# Altium project PCB_3U_DAC.PrjPCB (part 1 of 3)
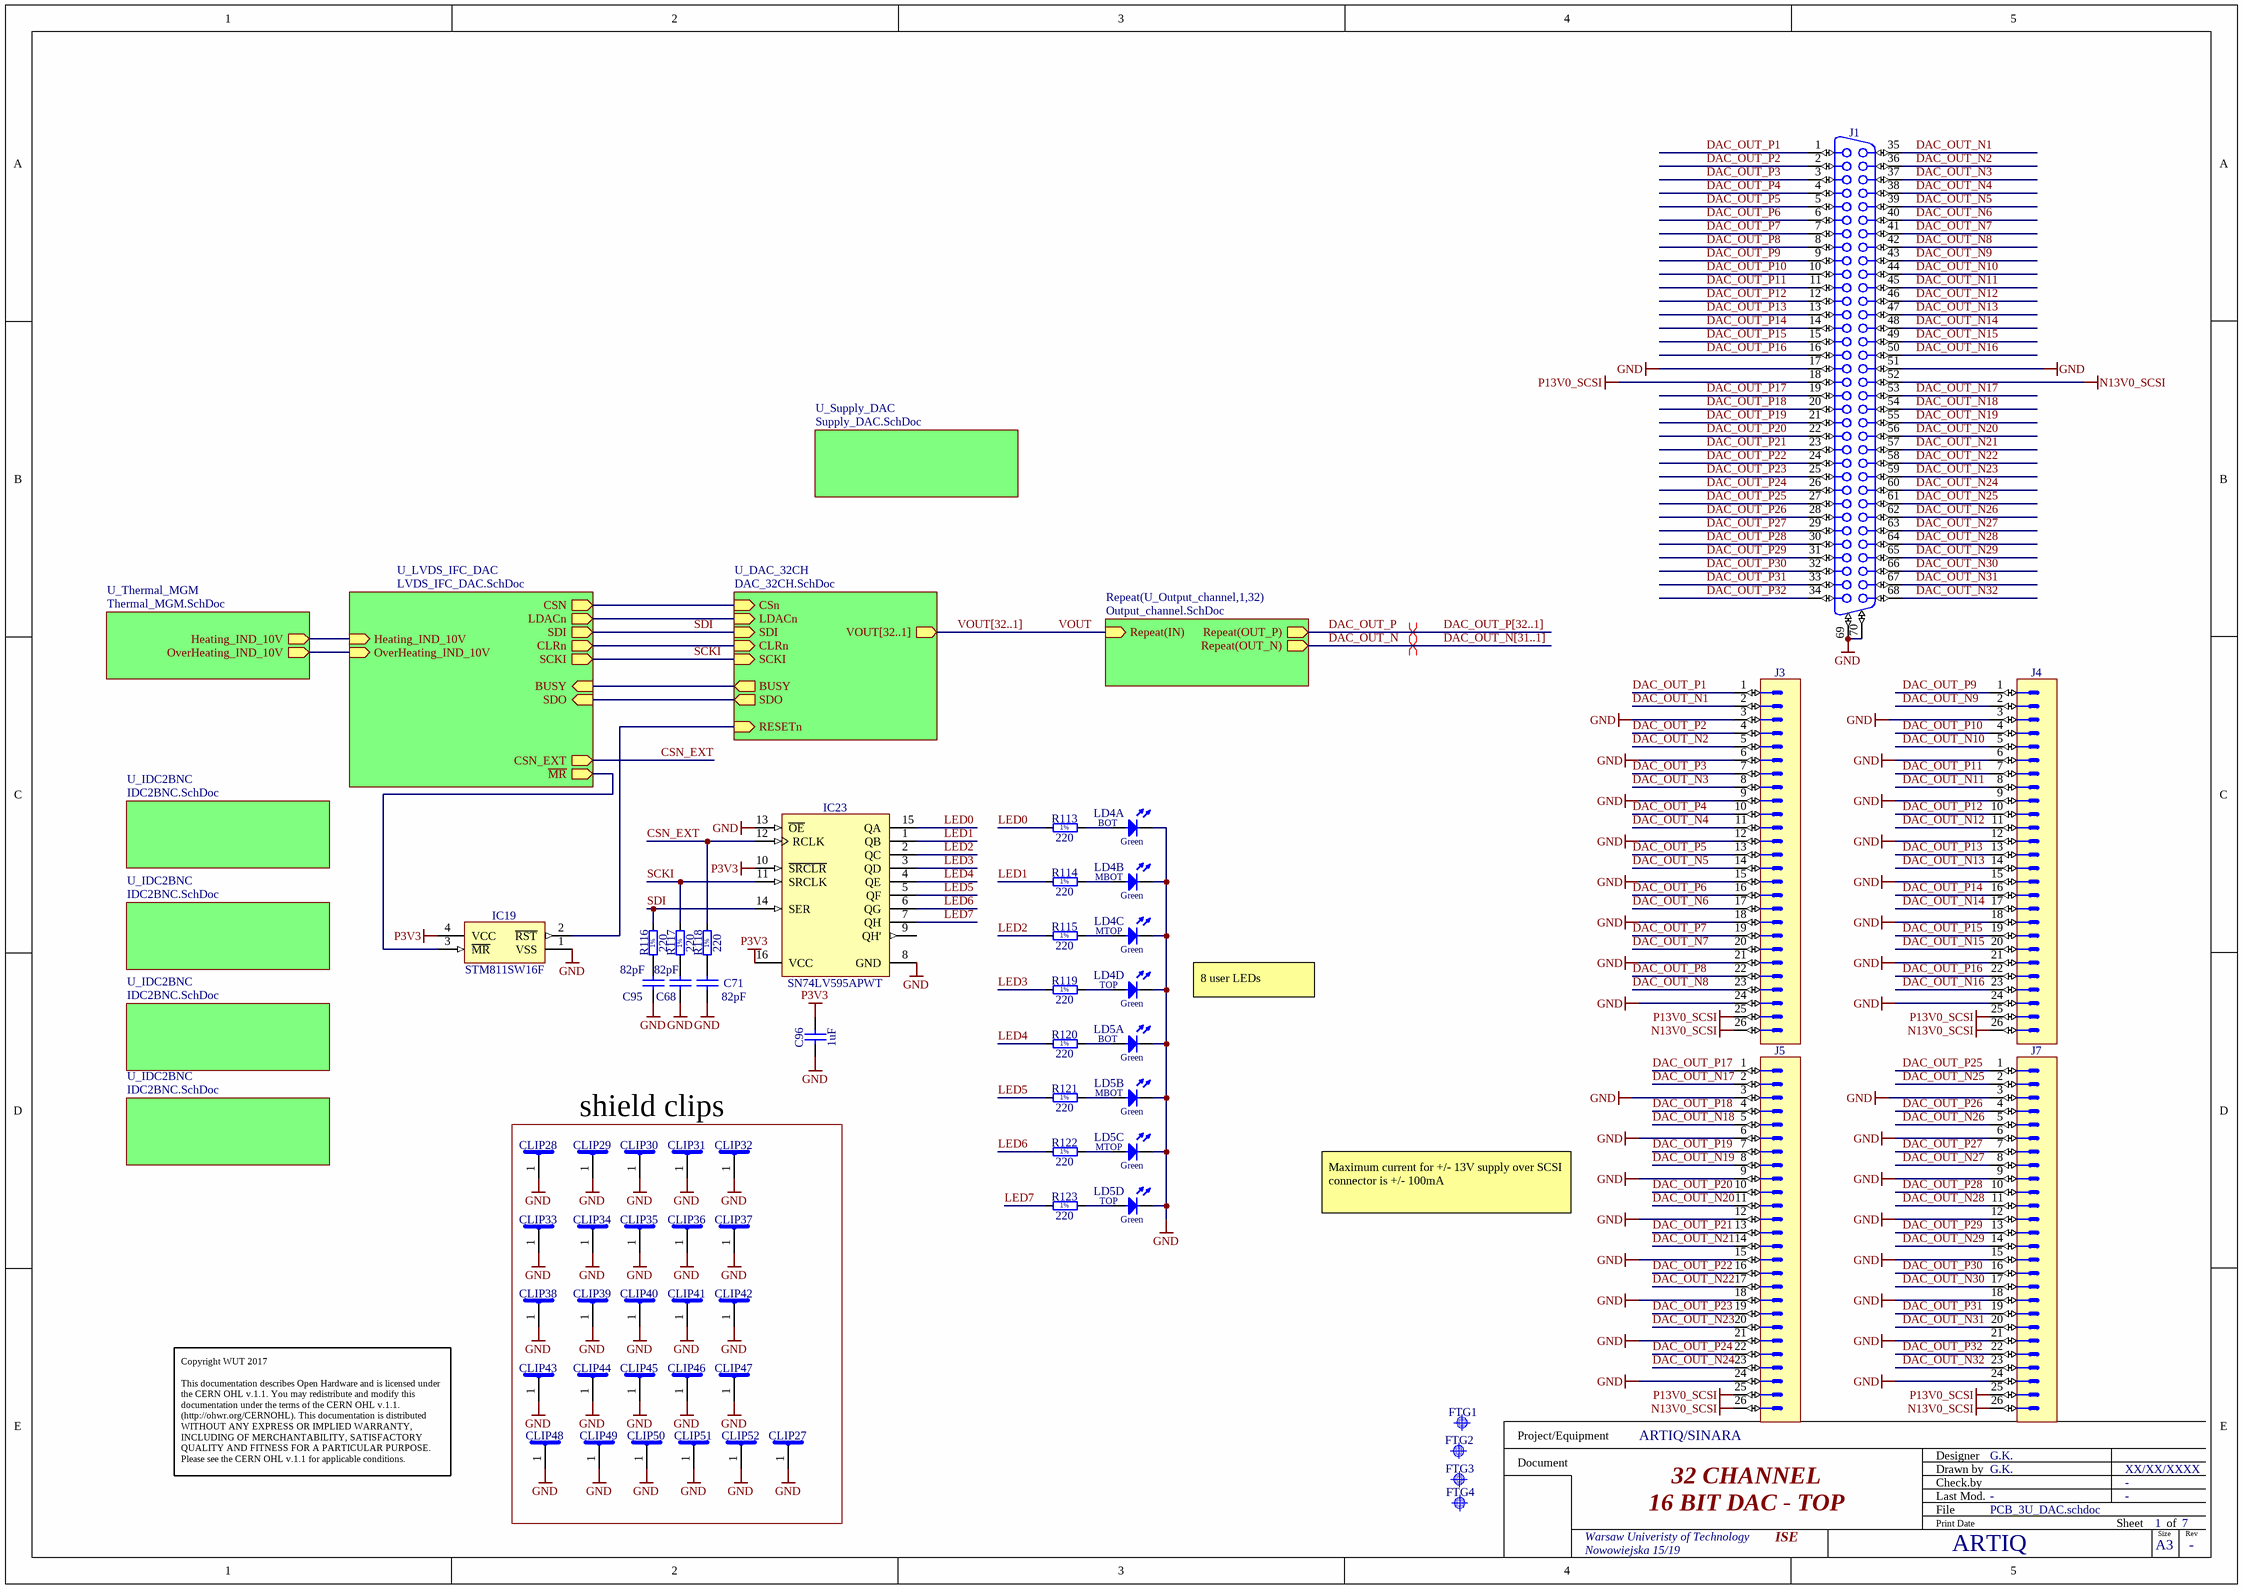
[diagram p0: PCB_3U_DAC.schdoc]
7 sheets, 825 parts. Net scope: hierarchical (ports join the sheet entries above them; power ports are global).
Board file: PCB_3U_DAC.PCBDOC
Sheets:
  PCB_3U_DAC.schdoc
    U_Supply_DAC = Supply_DAC.SchDoc
    U_Output_channel1 = Output_channel.SchDoc
    U_Output_channel2 = Output_channel.SchDoc
    U_Output_channel3 = Output_channel.SchDoc
    U_Output_channel4 = Output_channel.SchDoc
    U_Output_channel5 = Output_channel.SchDoc
    U_Output_channel6 = Output_channel.SchDoc
    U_Output_channel7 = Output_channel.SchDoc
    U_Output_channel8 = Output_channel.SchDoc
    U_Output_channel9 = Output_channel.SchDoc
    U_Output_channel10 = Output_channel.SchDoc
    U_Output_channel11 = Output_channel.SchDoc
    U_Output_channel12 = Output_channel.SchDoc
    U_Output_channel13 = Output_channel.SchDoc
    U_Output_channel14 = Output_channel.SchDoc
    U_Output_channel15 = Output_channel.SchDoc
    U_Output_channel16 = Output_channel.SchDoc
    U_Output_channel17 = Output_channel.SchDoc
    U_Output_channel18 = Output_channel.SchDoc
    U_Output_channel19 = Output_channel.SchDoc
    U_Output_channel20 = Output_channel.SchDoc
    U_Output_channel21 = Output_channel.SchDoc
    U_Output_channel22 = Output_channel.SchDoc
    U_Output_channel23 = Output_channel.SchDoc
    U_Output_channel24 = Output_channel.SchDoc
    U_Output_channel25 = Output_channel.SchDoc
    U_Output_channel26 = Output_channel.SchDoc
    U_Output_channel27 = Output_channel.SchDoc
    U_Output_channel28 = Output_channel.SchDoc
    U_Output_channel29 = Output_channel.SchDoc
    U_Output_channel30 = Output_channel.SchDoc
    U_Output_channel31 = Output_channel.SchDoc
    U_Output_channel32 = Output_channel.SchDoc
    U_DAC_32CH = DAC_32CH.SchDoc
    U_LVDS_IFC_DAC = LVDS_IFC_DAC.SchDoc
    U_Thermal_MGM = Thermal_MGM.SchDoc
    U_IDC2BNC = IDC2BNC.SchDoc
    U_IDC2BNC = IDC2BNC.SchDoc
    U_IDC2BNC = IDC2BNC.SchDoc
    U_IDC2BNC = IDC2BNC.SchDoc

## Sheet PCB_3U_DAC.schdoc: 32 CHANNEL
size 420 x 297 mm; Author: G.K.; CompanyName: WUT; DrawnBy: G.K.; Organization: WUT ISE; Address1: Warsaw Univeristy of Technology; Address2: Nowowiejska 15/19; DocumentNumber: 1; Revision: -; SheetNumber: 1; SheetTotal: 7; EDA_Number: ARTIQ; Projet: ARTIQ/SINARA; ModifiedBy: -; CreateDate: XX/XX/XXXX; CheckedDate: -; Title2: 16 BIT DAC - TOP; DivGrp: ISE; Designer: G.K.; ModifiedDate: -; ProjectName: 32 CHANNEL 16bit DAC

### Parts
C68  82pF  [CAPC1608X87N]
C71  82pF  [CAPC1608X87N]
C95  82pF  [CAPC1608X87N]
C96  1uF  [CAPC1608X87N]
CLIP27  S1411-46R  [CLIP_HOLLAND-SHIELDING_LC]  (value not drawn)
CLIP28  S1411-46R  [CLIP_HOLLAND-SHIELDING_LC]  (value not drawn)
CLIP29  S1411-46R  [CLIP_HOLLAND-SHIELDING_LC]  (value not drawn)
CLIP30  S1411-46R  [CLIP_HOLLAND-SHIELDING_LC]  (value not drawn)
CLIP31  S1411-46R  [CLIP_HOLLAND-SHIELDING_LC]  (value not drawn)
CLIP32  S1411-46R  [CLIP_HOLLAND-SHIELDING_LC]  (value not drawn)
CLIP33  S1411-46R  [CLIP_HOLLAND-SHIELDING_LC]  (value not drawn)
CLIP34  S1411-46R  [CLIP_HOLLAND-SHIELDING_LC]  (value not drawn)
CLIP35  S1411-46R  [CLIP_HOLLAND-SHIELDING_LC]  (value not drawn)
CLIP36  S1411-46R  [CLIP_HOLLAND-SHIELDING_LC]  (value not drawn)
CLIP37  S1411-46R  [CLIP_HOLLAND-SHIELDING_LC]  (value not drawn)
CLIP38  S1411-46R  [CLIP_HOLLAND-SHIELDING_LC]  (value not drawn)
CLIP39  S1411-46R  [CLIP_HOLLAND-SHIELDING_LC]  (value not drawn)
CLIP40  S1411-46R  [CLIP_HOLLAND-SHIELDING_LC]  (value not drawn)
CLIP41  S1411-46R  [CLIP_HOLLAND-SHIELDING_LC]  (value not drawn)
CLIP42  S1411-46R  [CLIP_HOLLAND-SHIELDING_LC]  (value not drawn)
CLIP43  S1411-46R  [CLIP_HOLLAND-SHIELDING_LC]  (value not drawn)
CLIP44  S1411-46R  [CLIP_HOLLAND-SHIELDING_LC]  (value not drawn)
CLIP45  S1411-46R  [CLIP_HOLLAND-SHIELDING_LC]  (value not drawn)
CLIP46  S1411-46R  [CLIP_HOLLAND-SHIELDING_LC]  (value not drawn)
CLIP47  S1411-46R  [CLIP_HOLLAND-SHIELDING_LC]  (value not drawn)
CLIP48  S1411-46R  [CLIP_HOLLAND-SHIELDING_LC]  (value not drawn)
CLIP49  S1411-46R  [CLIP_HOLLAND-SHIELDING_LC]  (value not drawn)
CLIP50  S1411-46R  [CLIP_HOLLAND-SHIELDING_LC]  (value not drawn)
CLIP51  S1411-46R  [CLIP_HOLLAND-SHIELDING_LC]  (value not drawn)
CLIP52  S1411-46R  [CLIP_HOLLAND-SHIELDING_LC]  (value not drawn)
FTG1  Use only in PCB  [FIDUCIAL_TOP_C100-200]  (value not drawn)
FTG2  Use only in PCB  [FIDUCIAL_TOP_S100-200]  (value not drawn)
FTG3  Use only in PCB  [FIDUCIAL_TOP_S200-400]  (value not drawn)
FTG4  Use only in PCB  [FIDUCIAL_TOP_S100-200]  (value not drawn)
IC19  STM811SW16F  [SOT143N]
IC23  SN74LV595APWT  [SOP65P640X120-16N]
J1  D-SUB  [TYCO_5787082-7]  (value not drawn)
J3  Header 26  [3M_N2526-6002RB]  (value not drawn)
J4  Header 26  [3M_N2526-6002RB]  (value not drawn)
J5  Header 26  [3M_N2526-6002RB]  (value not drawn)
J7  Header 26  [3M_N2526-6002RB]  (value not drawn)
LD4  Green  [LED_BIVAR_H485CGDL]  (value not drawn)  (parts A,B,C,D of 4)
LD5  Green  [LED_BIVAR_H485CGDL]  (value not drawn)  (parts A,B,C,D of 4)
R113  220  [RESC1608X55N]
R114  220  [RESC1608X55N]
R115  220  [RESC1608X55N]
R116  220  [RESC1608X55N]
R117  220  [RESC1608X55N]
R118  220  [RESC1608X55N]
R119  220  [RESC1608X55N]
R120  220  [RESC1608X55N]
R121  220  [RESC1608X55N]
R122  220  [RESC1608X55N]
R123  220  [RESC1608X55N]

### Blocks framed on the sheet
shield clips: CLIP27-CLIP52

### Sub-sheets
Repeat(U_Output_channel,1,32) = Output_channel.SchDoc: Repeat(IN) (in), Repeat(OUT_P) (out), Repeat(OUT_N) (out)
U_DAC_32CH = DAC_32CH.SchDoc: CSn (in), LDACn (in), BUSY (out), SDI (in), CLRn (in), SCKI (in), SDO (out), RESETn (in), VOUT[32..1] (out)
U_IDC2BNC = IDC2BNC.SchDoc: no entries
U_IDC2BNC = IDC2BNC.SchDoc: no entries
U_IDC2BNC = IDC2BNC.SchDoc: no entries
U_IDC2BNC = IDC2BNC.SchDoc: no entries
U_LVDS_IFC_DAC = LVDS_IFC_DAC.SchDoc: LDACn (out), BUSY (in), CSN (out), SCKI (out), SDI (out), CSN_EXT (out), CLRn (out), SDO (in), Heating_IND_10V (in), OverHeating_IND_10V (in), ~{MR} (out)
U_Supply_DAC = Supply_DAC.SchDoc: no entries
U_Thermal_MGM = Thermal_MGM.SchDoc: Heating_IND_10V (out), OverHeating_IND_10V (out)

### Nets
GND: C68.1 C71.1 C95.1 C96.1 CLIP27.1 CLIP28.1 CLIP29.1 CLIP30.1 CLIP31.1 CLIP32.1 CLIP33.1 CLIP34.1 CLIP35.1 CLIP36.1 CLIP37.1 CLIP38.1 CLIP39.1 CLIP40.1 CLIP41.1 CLIP42.1 CLIP43.1 CLIP44.1 CLIP45.1 CLIP46.1 CLIP47.1 CLIP48.1 CLIP49.1 CLIP50.1 CLIP51.1 CLIP52.1 IC19.1(VSS) IC23.8(GND) IC23.13(~{OE}) J1.17 J1.51 J1.69 J1.70 J3.3 J3.6 J3.9 J3.12 J3.15 J3.18 J3.21 J3.24 J4.3 J4.6 J4.9 J4.12 J4.15 J4.18 J4.21 J4.24 J5.3 J5.6 J5.9 J5.12 J5.15 J5.18 J5.21 J5.24 J7.3 J7.6 J7.9 J7.12 J7.15 J7.18 J7.21 J7.24 LD4.1(C) LD4.3(C) LD4.5(C) LD4.7(C) LD5.1(C) LD5.3(C) LD5.5(C) LD5.7(C)
N13V0_SCSI: J1.52 J3.26 J4.26 J5.26 J7.26
P3V3: C96.2 IC19.4(VCC) IC23.10(~{SRCLR}) IC23.16(VCC)
P13V0_SCSI: J1.18 J3.25 J4.25 J5.25 J7.25
CSN_EXT: IC23.12(RCLK) R118.2 ; sheet U_LVDS_IFC_DAC/CSN_EXT
DAC_OUT_N: sheet Repeat(U_Output_channel,1,32)/Repeat(OUT_N)
DAC_OUT_N1: J1.35 J3.2
DAC_OUT_N2: J1.36 J3.5
DAC_OUT_N3: J1.37 J3.8
DAC_OUT_N4: J1.38 J3.11
DAC_OUT_N5: J1.39 J3.14
DAC_OUT_N6: J1.40 J3.17
DAC_OUT_N7: J1.41 J3.20
DAC_OUT_N8: J1.42 J3.23
DAC_OUT_N9: J1.43 J4.2
DAC_OUT_N10: J1.44 J4.5
DAC_OUT_N11: J1.45 J4.8
DAC_OUT_N12: J1.46 J4.11
DAC_OUT_N13: J1.47 J4.14
DAC_OUT_N14: J1.48 J4.17
DAC_OUT_N15: J1.49 J4.20
DAC_OUT_N16: J1.50 J4.23
DAC_OUT_N17: J1.53 J5.2
DAC_OUT_N18: J1.54 J5.5
DAC_OUT_N19: J1.55 J5.8
DAC_OUT_N20: J1.56 J5.11
DAC_OUT_N21: J1.57 J5.14
DAC_OUT_N22: J1.58 J5.17
DAC_OUT_N23: J1.59 J5.20
DAC_OUT_N24: J1.60 J5.23
DAC_OUT_N25: J1.61 J7.2
DAC_OUT_N26: J1.62 J7.5
DAC_OUT_N27: J1.63 J7.8
DAC_OUT_N28: J1.64 J7.11
DAC_OUT_N29: J1.65 J7.14
DAC_OUT_N30: J1.66 J7.17
DAC_OUT_N31: J1.67 J7.20
DAC_OUT_N32: J1.68 J7.23
DAC_OUT_P: sheet Repeat(U_Output_channel,1,32)/Repeat(OUT_P)
DAC_OUT_P1: J1.1 J3.1
DAC_OUT_P2: J1.2 J3.4
DAC_OUT_P3: J1.3 J3.7
DAC_OUT_P4: J1.4 J3.10
DAC_OUT_P5: J1.5 J3.13
DAC_OUT_P6: J1.6 J3.16
DAC_OUT_P7: J1.7 J3.19
DAC_OUT_P8: J1.8 J3.22
DAC_OUT_P9: J1.9 J4.1
DAC_OUT_P10: J1.10 J4.4
DAC_OUT_P11: J1.11 J4.7
DAC_OUT_P12: J1.12 J4.10
DAC_OUT_P13: J1.13 J4.13
DAC_OUT_P14: J1.14 J4.16
DAC_OUT_P15: J1.15 J4.19
DAC_OUT_P16: J1.16 J4.22
DAC_OUT_P17: J1.19 J5.1
DAC_OUT_P18: J1.20 J5.4
DAC_OUT_P19: J1.21 J5.7
DAC_OUT_P20: J1.22 J5.10
DAC_OUT_P21: J1.23 J5.13
DAC_OUT_P22: J1.24 J5.16
DAC_OUT_P23: J1.25 J5.19
DAC_OUT_P24: J1.26 J5.22
DAC_OUT_P25: J1.27 J7.1
DAC_OUT_P26: J1.28 J7.4
DAC_OUT_P27: J1.29 J7.7
DAC_OUT_P28: J1.30 J7.10
DAC_OUT_P29: J1.31 J7.13
DAC_OUT_P30: J1.32 J7.16
DAC_OUT_P31: J1.33 J7.19
DAC_OUT_P32: J1.34 J7.22
LED0: IC23.15(QA) R113.1
LED1: IC23.1(QB) R114.1
LED2: IC23.2(QC) R115.1
LED3: IC23.3(QD) R119.1
LED4: IC23.4(QE) R120.1
LED5: IC23.5(QF) R121.1
LED6: IC23.6(QG) R122.1
LED7: IC23.7(QH) R123.1
SCKI: IC23.11(SRCLK) R117.2 ; sheet U_DAC_32CH/SCKI, sheet U_LVDS_IFC_DAC/SCKI
SDI: IC23.14(SER) R116.2 ; sheet U_DAC_32CH/SDI, sheet U_LVDS_IFC_DAC/SDI
VOUT: sheet Repeat(U_Output_channel,1,32)/Repeat(IN)
NetC68_2: C68.2 R117.1
NetC71_2: C71.2 R118.1
NetC95_2: C95.2 R116.1
NetIC13_4: sheet U_LVDS_IFC_DAC/OverHeating_IND_10V, sheet U_Thermal_MGM/OverHeating_IND_10V
NetIC13_5: sheet U_LVDS_IFC_DAC/Heating_IND_10V, sheet U_Thermal_MGM/Heating_IND_10V
NetIC13_10: IC19.3(~{MR}) ; sheet U_LVDS_IFC_DAC/~{MR}
NetIC18_1: IC19.2(~{RST}) ; sheet U_DAC_32CH/RESETn
NetIC18_2: sheet U_DAC_32CH/BUSY, sheet U_LVDS_IFC_DAC/BUSY
NetIC18_53: sheet U_DAC_32CH/CSn, sheet U_LVDS_IFC_DAC/CSN
NetIC18_56: sheet U_DAC_32CH/SDO, sheet U_LVDS_IFC_DAC/SDO
NetIC18_63: sheet U_DAC_32CH/LDACn, sheet U_LVDS_IFC_DAC/LDACn
NetIC18_64: sheet U_DAC_32CH/CLRn, sheet U_LVDS_IFC_DAC/CLRn
NetLD4_2: LD4.2(A) R113.2
NetLD4_4: LD4.4(A) R114.2
NetLD4_6: LD4.6(A) R115.2
NetLD4_8: LD4.8(A) R119.2
NetLD5_2: LD5.2(A) R120.2
NetLD5_4: LD5.4(A) R121.2
NetLD5_6: LD5.6(A) R122.2
NetLD5_8: LD5.8(A) R123.2

Not connected (* = marked no-connect by the designer): IC23 9(QH')

### Buses and harness runs
bus DAC_OUT_N[31..1]
bus DAC_OUT_P[32..1]
bus VOUT[32..1] = sheet U_DAC_32CH/VOUT[32..1]

### Layout directives
differential pair: DAC_OUT_N, DAC_OUT_P

### Notes on the sheet
- 8 user LEDs
- Maximum current for +/- 13V supply over SCSI connector is +/- 100mA
- Copyright WUT 2017
  This documentation describes Open Hardware and is licensed under the CERN OHL v.1.1. You may redistribute and modify this documentation under the terms of the CERN OHL v.1.1. (http://ohwr.org/CERNOHL). This documentation is distributed WITHOUT ANY EXPRESS OR IMPLIED WARRANTY, INCLUDING OF MERCHANTABILITY, SATISFACTORY QUALITY AND FITNESS FOR A PARTICULAR PURPOSE. Please see the CERN OHL v.1.1 for applicable conditions.
- Project/Equipment
- Document
- Designer
- Drawn by
- Check.by
- File
- Last Mod.
- Print Date
- Sheet
- Size
- A3
- of
- Rev
- (in symbol LED_BIVAR_H485CGDL, part A) BOT
- (in symbol LED_BIVAR_H485CGDL, part B) MBOT
- (in symbol LED_BIVAR_H485CGDL, part C) MTOP
- (in symbol LED_BIVAR_H485CGDL, part D) TOP
- (in symbol R0603_220R_1%_0.1W_100PPM) 1%

### Library data of the parts
C68 C71 C95 = CC0603_82PF_50V_5%_NP0: Non-polarised capacitor; Part Description: SMD Multilayer Chip Ceramic Capacitor; Manufacturer: GENERIC; Manufacturer1 Part Number: 223886715829; Voltage: 50V; TC: C0G/NP0; Tolerance: ±5%; Part Number: CC0603_82PF_50V_5%_NP0; Component Kind: Standard; Component Type: Standard; Pin Count: 2; Value: 82pF; Status: Preferred; Manufacturer Part Number: CC0603_82PF_50V_5%_NP0; Case: 0603; Mounted: Yes; Socket: No; SMD: Yes; Sense: No; Manufacturer1 Example: PHYCOMP; Manufacturer1 ComponentHeight: 0.87mm; HelpURL: \\cern.ch\dfs\Applications\Altium\Datasheets\CC0603_NP0_PHYCOMP.pdf; Author: CERN DEM JLC; CreateDate: 03.12.2007; LatestRevisionDate: 03.12.2007
C96 = CC0603_1UF_25V_10%_X7R: Non-polarised capacitor; Part Description: SMD Multilayer Chip Ceramic Capacitor; Manufacturer: GENERIC; Manufacturer1 Part Number: GRM188R71E105KA12D; Voltage: 25V; TC: X7R; Tolerance: ±10%; Part Number: CC0603_1UF_25V_10%_X7R; Component Kind: Standard; Component Type: Standard; Pin Count: 2; Value: 1uF; Status: None; Manufacturer Part Number: CC0603_1UF_25V_10%_X7R; Case: 0603; Mounted: Yes; Socket: No; SMD: Yes; Sense: No; Manufacturer1 Example: MURATA; Manufacturer1 ComponentHeight: 0.9mm; HelpURL: \\cern.ch\dfs\Applications\Altium\Datasheets\CC0603_X7R_MURATA.pdf; Author: CERN DEM JLC; CreateDate: 18.01.2011; LatestRevisionDate: 18.01.2011
CLIP27-CLIP52 = SHIELD_CLIP: Surface Mount Clip for PCB Screening Covers; Part Description: Surface Mount Clip for PCB Screening Covers, 1500 Serie; Manufacturer: HARWIN; PressFit: No; Table: Metal Screening Box; Part Number: S1411-46R; Component Kind: Standard; Component Type: Standard; Pin Count: 1; PackageDescription: Surface Mount Clip for PCB Screening Covers, 1500 Serie; Mounted: Yes; Socket: No; SMD: Yes; Status: None; Manufacturer Part Number: S1411-46R; ComponentHeight: 3.5mm; HelpURL: \\cern.ch\dfs\Applications\Altium\Datasheets\CLIP_HOLLAND-SHIELDING_LC.pdf; Author: CERN DEM JLC; CreateDate: 2013-06-25; LatestRevisionDate: 2013-06-25
FTG1 = FIDUCIAL_TARGET_C100-200: Fiducial Target; Part Description: Round Fiducial Target, Top Layer, 1.0mm, Top Solder 2.0mm, Keepout =2.0mm; Mounted: No; Part Number: FIDUCIAL_TARGET_C100-200; Component Kind: Standard (No BOM); Component Type: Standard (No BOM); Pin Count: 1; Family: Fiducial; Socket: No; SMD: Yes; Sense: No; Status: None; ComponentHeight: 0mm; HelpURL: Undefined; Author: CERN DEM JLC; CreateDate: 09.02.2010; LatestRevisionDate: 04.04.2012; PackageDescription: Round Fiducial Target, Top Layer, 1.0mm, Top Solder 2.0mm, Keepout =2.0mm
FTG2 FTG4 = FIDUCIAL_TARGET_S100-200: Fiducial Target; Part Description: Square Fiducial Target, Top Layer, 1.0mm, Top Solder 2.0mm, Keepout =2.0mm; Mounted: No; Part Number: FIDUCIAL_TARGET_S100-200; Component Kind: Standard (No BOM); Component Type: Standard (No BOM); Pin Count: 1; Family: Fiducial; Socket: No; SMD: Yes; Sense: No; Status: None; ComponentHeight: 0mm; HelpURL: Undefined; Author: CERN DEM JLC; CreateDate: 09.02.2010; LatestRevisionDate: 04.04.2012; PackageDescription: Square Fiducial Target, Top Layer, 1.0mm, Top Solder 2.0mm, Keepout =2.0mm
FTG3 = FIDUCIAL_TARGET_S200-400: Fiducial Target; Part Description: Square Fiducial Target, Top Layer, 2.0mm, Top Solder 4.0mm, Keepout =4.0mm; Mounted: No; Part Number: FIDUCIAL_TARGET_S200-400; Component Kind: Standard (No BOM); Component Type: Standard (No BOM); Pin Count: 1; Family: Fiducial; Socket: No; SMD: Yes; Sense: No; Status: None; ComponentHeight: 0mm; HelpURL: Undefined; Author: CERN DEM JLC; CreateDate: 02.06.2008; LatestRevisionDate: 04.04.2012; PackageDescription: Square Fiducial Target, Top Layer, 2.0mm, Top Solder 4.0mm, Keepout =4.0mm
IC19 = STM811SW16F: Microprocessor Reset Circuit; Part Description: 2.93V Reset Threshold Voltage Microprocessor Reset Circuit; Manufacturer: ST MICROELECTRONICS; PressFit: No; Bonding: No; Part Number: STM811SW16F; Component Kind: Standard; Component Type: Standard; Device: STM811SW16F; PackageDescription: SOT143, 4-Leads, Body 3.0x2.6mm (max), Pitch 1.92mm, IPC Medium Density; Manufacturer Part Number: STM811SW16F; Pin Count: 4; Case: SOT143; Mounted: Yes; Socket: No; SMD: Yes; Sense: No; ComponentHeight: 1.12mm; Author: CERN DEM JLC; HelpURL: \\cern.ch\dfs\Applications\Altium\Datasheets\STM811SW16F.pdf; CreateDate: 17.11.2016; LatestRevisionDate: 17.11.2016
IC23 = SN74LV595APWT: 8-Bit Shift Register With 3-State Output Register; Manufacturer: TEXAS INSTRUMENTS; PressFit: No; Bonding: No; Part Number: SN74LV595APWT; Component Kind: Standard; Component Type: Standard; Device: SN74LV595APWT; PackageDescription: SOP, 0.65mm pitch; 16 pin, 4.40mm W X 5.00mm L X 1.20mm H body IPC Medium Density; Part Description: 8-Bit Shift Register With 3-State Output Register; Manufacturer Part Number: SN74LV595APWT; Pin Count: 16; Case: TSSOP16; Mounted: Yes; Socket: No; SMD: Yes; Sense: No; ComponentHeight: 1.2mm; Author: CERN DEM JLC; HelpURL: \\cern.ch\dfs\Applications\Altium\Datasheets\SN74LV595APWT.pdf; CreateDate: 10.05.2012; LatestRevisionDate: 10.05.2012
J1 = TYCO_5787082-7: 68 contacts, AMPLIMITE .050", Right Angled Receptacle Series III; Manufacturer: TYCO ELECTRONICS; PressFit: No; Part Number: TYCO_5787082-7; Component Kind: Standard; Component Type: Standard; Pin Count: 70; Family: D-SUB; Mounted: Yes; Socket: No; SMD: No; Sense: No; Status: None; Part Description: 68 contacts, AMPLIMITE .050", Right Angled Receptacle Series III; Manufacturer Part Number: 5787082-7; ComponentHeight: 9.5mm; HelpURL: \\cern.ch\dfs\Applications\Altium\Datasheets\TYCO_5787082-7.pdf; Author: CERN DEM JLC; CreateDate: 13.03.2017; LatestRevisionDate: 13.03.2017
J3-J5 J7 = 3M_N2526-6002RB: Connector 26 Male; Part Description: 26 Contacts - Straight .100'' x .100'' Low Profile Four-Wall Header, 2500 Series; Manufacturer: 3M; PressFit: No; Part Number: 3M_N2526-6002RB; Component Kind: Standard; Component Type: Standard; Pin Count: 26; Family: Header 26; Mounted: Yes; Socket: No; SMD: No; Sense: No; Status: None; Manufacturer Part Number: N2526-6002RB; ComponentHeight: 10.03mm; HelpURL: \\cern.ch\dfs\Applications\Altium\Datasheets\3M_N2526-6002RB.pdf; Author: CERN DEM JLC; CreateDate: 11.02.2009; LatestRevisionDate: 11.08.2009
LD4 LD5 = LED_BIVAR_H485CGDL: LED x4 Green 1C2A-BOT_3C4A_5C6A_7C8A-TOP; Part Description: Quad-Level 2mm Green LED, PCB Edge Mounting; Manufacturer: BIVAR; PressFit: No; Bonding: No; Part Number: LED_BIVAR_H485CGDL; Component Kind: Standard; Component Type: Standard; Color: Green; PackageDescription: Quad-Level 2mm Green, PCB Edge Mounting  BIVAR H485CHDL; Manufacturer Part Number: H485CGDL; Pin Count: 8; Mounted: Yes; Socket: No; SMD: No; Sense: No; ComponentHeight: 11.3mm; HelpURL: \\cern.ch\dfs\Applications\Altium\Datasheets\LED_BIVAR_H485CGDL.pdf; Author: CERN DEM JLC; CreateDate: 04.06.2012; LatestRevisionDate: 04.06.2012
R113-R123 = R0603_220R_1%_0.1W_100PPM: Resistor - 1%; Part Description: General Purpose Thick Film Chip Resistor; Manufacturer: GENERIC; Manufacturer1 Part Number: NRC06F2200TRF; Power: 0.1W; TC: ±100ppm/°C; Part Number: R0603_220R_1%_0.1W_100PPM; Component Kind: Standard; Component Type: Standard; Pin Count: 2; Value: 220; Status: Preferred; Tolerance: ±1%; Manufacturer Part Number: R0603_220R_1%_0.1W_100PPM; Case: 0603; Mounted: Yes; Sense: No; Socket: No; SMD: Yes; Manufacturer1 Example: NIC COMPONENT; Manufacturer1 ComponentHeight: 0.55mm; HelpURL: \\cern.ch\dfs\Applications\Altium\Datasheets\R0603_NIC_NRC.pdf; Author: CERN DEM JLC; CreateDate: 03.12.2007; LatestRevisionDate: 13.03.2008

## Sheet Supply_DAC.SchDoc: Power
size 420 x 297 mm; Author: G.K.; CompanyName: WUT; DrawnBy: G.K.; Organization: WUT ISE; Address1: Warsaw Univeristy of Technology; Address2: Nowowiejska 15/19; Revision: -; SheetNumber: -; SheetTotal: -; EDA_Number: ARTIQ; Projet: ARTIQ/SINARA; ModifiedBy: -; CreateDate: XX/XX/XXXX; CheckedDate: -; Title2: supply; DivGrp: ISE; Designer: G.K.; ModifiedDate: -; ProjectName: 32 CHANNEL 16bit DAC
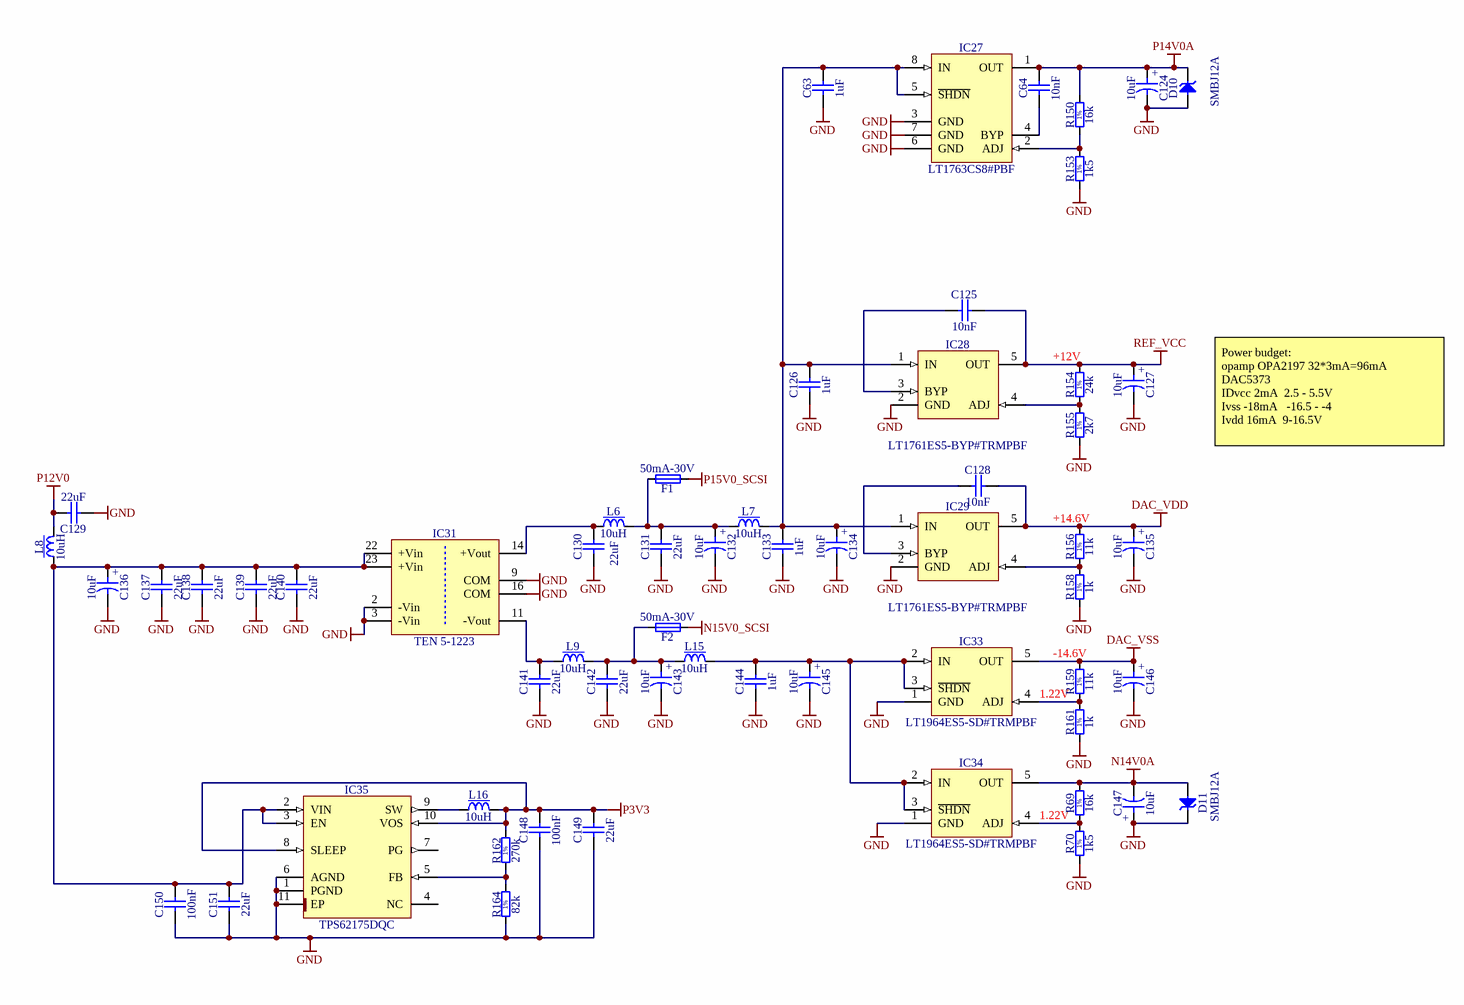
[diagram p1: Supply_DAC.SchDoc]

### Parts
C63  1uF  [CAPC1608X87N]
C64  10nF  [CAPC1608X87N]
C124  10uF  [CAPMP3216X180N]
C125  10nF  [CAPC1608X87N]
C126  1uF  [CAPC1608X87N]
C127  10uF  [CAPMP3216X180N]
C128  10nF  [CAPC1608X87N]
C129  22uF  [CAPC2012X135N]
C130  22uF  [CAPC2012X135N]
C131  22uF  [CAPC2012X135N]
C132  10uF  [CAPMP3216X180N]
C133  1uF  [CAPC1608X87N]
C134  10uF  [CAPMP3216X180N]
C135  10uF  [CAPMP3216X180N]
C136  10uF  [CAPMP3216X180N]
C137  22uF  [CAPC2012X135N]
C138  22uF  [CAPC2012X135N]
C139  22uF  [CAPC2012X135N]
C140  22uF  [CAPC2012X135N]
C141  22uF  [CAPC2012X135N]
C142  22uF  [CAPC2012X135N]
C143  10uF  [CAPMP3216X180N]
C144  1uF  [CAPC1608X87N]
C145  10uF  [CAPMP3216X180N]
C146  10uF  [CAPMP3216X180N]
C147  10uF  [CAPMP3216X180N]
C148  100nF  [CAPC1005X55N]
C149  22uF  [CAPC2012X135N]
C150  100nF  [CAPC1005X55N]
C151  22uF  [CAPC2012X135N]
D10  SMBJ12A  [DIOM5336X265N]
D11  SMBJ12A  [DIOM5336X265N]
F1  50mA-30V  [FUSRC3226X85N]
F2  50mA-30V  [FUSRC3226X85N]
IC27  LT1763CS8#PBF  [SOIC127P600X175-8N]
IC28  LT1761ES5-BYP#TRMPBF  [SOT95P280X100-5N]
IC29  LT1761ES5-BYP#TRMPBF  [SOT95P280X100-5N]
IC31  TEN 5-1223  [DCDC_TRACO_TEN5WI]
IC33  LT1964ES5-SD#TRMPBF  [SOT95P280X100-5N]
IC34  LT1964ES5-SD#TRMPBF  [SOT95P280X100-5N]
IC35  TPS62175DQC  [SON50P200X300X80-11N-R94X250]
L6  10uH  [IND_MURATA-PS_8400]
L7  10uH  [IND_MURATA-PS_8400]
L8  10uH  [IND_MURATA-PS_8400]
L9  10uH  [IND_MURATA-PS_8400]
L15  10uH  [IND_MURATA-PS_8400]
L16  10uH  [IND_MURATA-PS_8400]
R69  16k  [RESC1608X55N]
R70  1k5  [RESC1608X55N]
R150  16k  [RESC1608X55N]
R153  1k5  [RESC1608X55N]
R154  24k  [RESC1608X55N]
R155  2k7  [RESC1608X55N]
R156  11k  [RESC1608X55N]
R158  1k  [RESC1608X55N]
R159  11k  [RESC1608X55N]
R161  1k  [RESC1608X55N]
R162  270k  [RESC1608X55N]
R164  82k  [RESC1608X55N]

### Nets
DAC_VDD: C128.2 C135.1 IC29.5(OUT) R156.2
DAC_VSS: C146.1 IC33.5(OUT) R159.2
GND: C63.1 C124.2 C126.1 C127.2 C129.1 C130.1 C131.1 C132.2 C133.1 C134.2 C135.2 C136.2 C137.1 C138.1 C139.1 C140.1 C141.1 C142.1 C143.2 C144.1 C145.2 C146.2 C147.1 C148.1 C149.1 C150.1 C151.1 D10.2(A) D11.1(C) IC27.3(GND) IC27.6(GND) IC27.7(GND) IC28.2(GND) IC29.2(GND) IC31.2(-Vin) IC31.3(-Vin) IC31.9(COM) IC31.16(COM) IC33.1(GND) IC34.1(GND) IC35.1(PGND) IC35.6(AGND) IC35.11(EP) R70.1 R153.1 R155.1 R158.1 R161.1 R164.1
N14V0A: C147.2 D11.2(A) IC34.5(OUT) R69.2
N15V0_SCSI: F2.1
P3V3: C148.2 C149.2 IC35.8(SLEEP) IC35.10(VOS) L16.2 R162.2
P12V0: C129.2 L8.2
P14V0A: C64.2 C124.1 D10.1(C) IC27.1(OUT) R150.2
P15V0_SCSI: F1.1
REF_VCC: C125.2 C127.1 IC28.5(OUT) R154.2
NetC63_2: C63.2 C126.2 C133.2 C134.1 IC27.5(~{SHDN}) IC27.8(IN) IC28.1(IN) IC29.1(IN) L7.2
NetC64_1: C64.1 IC27.4(BYP)
NetC125_1: C125.1 IC28.3(BYP)
NetC128_1: C128.1 IC29.3(BYP)
NetC130_2: C130.2 IC31.14(+Vout) L6.1
NetC131_2: C131.2 C132.1 F1.2 L6.2 L7.1
NetC136_1: C136.1 C137.2 C138.2 C139.2 C140.2 C150.2 C151.2 IC31.22(+Vin) IC31.23(+Vin) IC35.2(VIN) IC35.3(EN) L8.1
NetC141_2: C141.2 IC31.11(-Vout) L9.1
NetC142_2: C142.2 C143.1 F2.2 L9.2 L15.1
NetC144_2: C144.2 C145.1 IC33.2(IN) IC33.3(~{SHDN}) IC34.2(IN) IC34.3(~{SHDN}) L15.2
NetIC27_2: IC27.2(ADJ) R150.1 R153.2
NetIC28_4: IC28.4(ADJ) R154.1 R155.2
NetIC29_4: IC29.4(ADJ) R156.1 R158.2
NetIC33_4: IC33.4(ADJ) R159.1 R161.2
NetIC34_4: IC34.4(ADJ) R69.1 R70.2
NetIC35_5: IC35.5(FB) R162.1 R164.2
NetIC35_9: IC35.9(SW) L16.1

Not connected (* = marked no-connect by the designer): IC35 4(NC) 7(PG)

### Notes on the sheet
- (near R154) +12V
- Power budget:
  opamp OPA2197 32*3mA=96mA
  DAC5373
  IDvcc 2mA  2.5 - 5.5V
  Ivss -18mA   -16.5 - -4
  Ivdd 16mA  9-16.5V
- (near R156) +14.6V
- (near R159) -14.6V
- 1.22V
- Project/Equipment
- Document
- Designer
- Drawn by
- Check.by
- File
- Last Mod.
- Print Date
- Sheet
- Size
- A3
- of
- Rev
- (in symbol CTE3216-18_10UF_16V_20%_AVX_TCJ) +
- (in symbol R0603_1K5_1%_0.1W_100PPM) 1%
- (in symbol R0603_1K_1%_0.1W_100PPM) 1%
- (in symbol R0603_2K7_1%_0.1W_100PPM) 1%
- (in symbol R0603_11K_1%_0.1W_100PPM) 1%
- (in symbol R0603_16K_1%_0.1W_100PPM) 1%
- (in symbol R0603_24K_1%_0.1W_100PPM) 1%
- (in symbol R0603_82K_1%_0.1W_100PPM) 1%
- (in symbol R0603_270K_1%_0.1W_100PPM) 1%

### Library data of the parts
C63 C126 C133 C144 = CC0603_1UF_25V_10%_X7R: as C96 on sheet PCB_3U_DAC; Part Number: CC0603_1UF_25V_10%_X7R; Component Kind: Standard; Component Type: Standard; Pin Count: 2; Value: 1uF; Status: None; Manufacturer Part Number: CC0603_1UF_25V_10%_X7R; Case: 0603; Mounted: Yes; Socket: No; SMD: Yes; Sense: No; Manufacturer1 Example: MURATA; Manufacturer1 ComponentHeight: 0.9mm; HelpURL: \\cern.ch\dfs\Applications\Altium\Datasheets\CC0603_X7R_MURATA.pdf; Author: CERN DEM JLC; CreateDate: 18.01.2011; LatestRevisionDate: 18.01.2011
C64 C125 C128 = CC0603_10NF_50V_10%_X7R: Non-polarised capacitor; Part Description: SMD Multilayer Chip Ceramic Capacitor; Manufacturer: GENERIC; Manufacturer1 Part Number: 223858615636; Voltage: 50V; TC: X7R; Tolerance: ±10%; Part Number: CC0603_10NF_50V_10%_X7R; Component Kind: Standard; Component Type: Standard; Pin Count: 2; Value: 10nF; Status: Preferred; Manufacturer Part Number: CC0603_10NF_50V_10%_X7R; Case: 0603; Mounted: Yes; Socket: No; SMD: Yes; Sense: No; Manufacturer1 Example: PHYCOMP; Manufacturer1 ComponentHeight: 0.87mm; HelpURL: \\cern.ch\dfs\Applications\Altium\Datasheets\CC0603_X7R_PHYCOMP.pdf; Author: CERN DEM JLC; CreateDate: 03.12.2007; LatestRevisionDate: 03.12.2007
C124 C127 C132 C134-C136 C143 C145-C147 = CTE3216-18_10UF_16V_20%_AVX_TCJ: Polarised capacitor; Part Description: ESR 0R200 Tantalum Solid Electrolytic Chip Capacitor with Conductive Polymer Electrode; Manufacturer: AVX; Manufacturer Part Number: TCJA106M016R0200; Voltage: 16V; Tolerance: ±20%; Part Number: CTE3216-18_10UF_16V_20%_AVX_TCJ; Component Kind: Standard; Component Type: Standard; Pin Count: 2; Value: 10uF; Status: Preferred; Case: A; Mounted: Yes; Socket: No; SMD: Yes; Sense: No; ComponentHeight: 1.8mm; HelpURL: \\cern.ch\dfs\Applications\Altium\Datasheets\CTE_AVX_TCJ.pdf; Author: CERN DEM JLC; CreateDate: 29.03.2012; LatestRevisionDate: 29.03.2012
C129-C131 C137-C142 C149 C151 = CC0805_22UF_16V_10%_X5R: Non-polarised capacitor; Part Description: SMD Multilayer Chip Ceramic Capacitor; Manufacturer: GENERIC; Manufacturer1 Part Number: C2012X5R1C226KT; Voltage: 16V; TC: X5R; Tolerance: ±10%; Part Number: CC0805_22UF_16V_10%_X5R; Component Kind: Standard; Component Type: Standard; Pin Count: 2; Value: 22uF; Status: Preferred; Manufacturer Part Number: CC0805_22UF_16V_10%_X5R; Case: 0805; Mounted: Yes; Socket: No; SMD: Yes; Sense: No; Manufacturer1 Example: TDK; Manufacturer1 ComponentHeight: 1.35mm; HelpURL: \\cern.ch\dfs\Applications\Altium\Datasheets\CC0805_X5R_TDK_C.pdf; Author: CERN DEM JLC; CreateDate: 25.10.2012; LatestRevisionDate: 25.10.2012
C148 C150 = CC0402_100NF_16V_10%_X5R: Non-polarised capacitor; Part Description: SMD Multilayer Chip Ceramic Capacitor; Manufacturer: GENERIC; Manufacturer1 Part Number: GRM155R61C104KA88D; Voltage: 16V; TC: X5R; Tolerance: ±10%; Part Number: CC0402_100NF_16V_10%_X5R; Component Kind: Standard; Component Type: Standard; Pin Count: 2; Value: 100nF; Status: None; Manufacturer Part Number: CC0402_100NF_16V_10%_X5R; Case: 0402; Mounted: Yes; Socket: No; SMD: Yes; Sense: No; Manufacturer1 Example: MURATA; Manufacturer1 ComponentHeight: 0.55mm; HelpURL: \\cern.ch\dfs\Applications\Altium\Datasheets\CC0402_X5R_MURATA_GRM.pdf; Author: CERN DEM JLC; CreateDate: 10.12.2013; LatestRevisionDate: 10.12.2013
D10 D11 = SMBJ12A: Zener Diode; Part Description: Uni-Directional Transient Voltage Suppressor Diode; Manufacturer: FAIRCHILD SEMICONDUCTOR; Voltage: 12V; Power: 600W; PressFit: No; Bonding: No; Part Number: SMBJ12A; Component Kind: Standard; Component Type: Standard; Device: SMBJ12A; PackageDescription: DO-214-AA/SMB Diode, Molded Body; 5.34mm L X 3.625mm W X 2.65mm H, IPC Medium Density; Manufacturer Part Number: SMBJ12A; Pin Count: 2; Case: DO-214AA; Mounted: Yes; Socket: No; SMD: Yes; Sense: No; ComponentHeight: 2.65mm; HelpURL: \\cern.ch\dfs\Applications\Altium\Datasheets\SMBJ.pdf; Author: CERN DEM JLC; CreateDate: 10.04.2013; LatestRevisionDate: 10.04.2013
F1 F2 = FUSR1210_TYCO-MICROSMD005F: Fuse; Part Description: PolySwitch® PTC Overcurrent Protection Device; Manufacturer: TYCO ELECTRONICS; PressFit: No; Part Number: FUSR1210_TYCO-MICROSMD005F; Component Kind: Standard; Component Type: Standard; Pin Count: 2; PackageDescription: Chip Resettable Fuse, 2-Leads, Body 3.2mm x 2.6mm, IPC Medium Density; Family: Fuses Resettable; Mounted: Yes; Socket: No; SMD: Yes; Sense: No; Value: 50mA-30V; Manufacturer Part Number: microSMD005F; ComponentHeight: 0.85mm; HelpURL: \\cern.ch\dfs\Applications\Altium\Datasheets\FUSR_TYCO_microSMD005F.pdf; Author: CERN DEM JLC; CreateDate: 14.12.2010; LatestRevisionDate: 14.12.2010
IC27 = LT1763CS8#PBF: 1.22V to 20V 500mA, Low Noise, LDO Adjustable Micropower Regulator; Manufacturer: LINEAR TECHNOLOGY; PressFit: No; Bonding: No; Part Number: LT1763CS8#PBF; Component Kind: Standard; Component Type: Standard; Device: LT1763CS8#PBF; PackageDescription: SOIC 8, Pitch 1.27mm, Body 4x5mm, IPC Medium Density; Part Description: 1.22V to 20V 500mA, Low Noise, LDO Adjustable Micropower Regulator; Manufacturer Part Number: LT1763CS8#PBF; Pin Count: 8; Case: SOIC8; Mounted: Yes; Socket: No; SMD: Yes; Sense: No; ComponentHeight: 1.75mm; HelpURL: \\cern.ch\dfs\Applications\Altium\Datasheets\LT1763CS8#PBF.pdf; Author: CERN DEM JLC; CreateDate: 11.01.2010; LatestRevisionDate: 11.01.2010
IC28 IC29 = LT1761ES5-BYP#TRMPBF: 100mA, Low Noise, LDO Micropower Adjustable Regulator in SOT-23; Part Description: 1.22V to 20V, 100mA, Low Noise, LDO Adjustable Micropower Regulator; Manufacturer: LINEAR TECHNOLOGY; PressFit: No; Bonding: No; Part Number: LT1761ES5-BYP#TRMPBF; Component Kind: Standard; Component Type: Standard; Device: LT1761ES5-BYP#TRMPBF; PackageDescription: SOT23, 0.95mm pitch; 5 pin, 1.6mm W X 2.9mm L, IPC Medium Density; Manufacturer Part Number: LT1761ES5-BYP#TRMPBF; Pin Count: 5; Case: SOT23; Mounted: Yes; Socket: No; SMD: Yes; Sense: No; ComponentHeight: 1mm; HelpURL: \\cern.ch\dfs\Applications\Altium\Datasheets\LT1761ES5-SD#TRMPBF.pdf; Author: CERN DEM MR; CreateDate: 17.02.2016; LatestRevisionDate: 17.02.2016
IC31 = DCDC_TRACO_TEN 5-1223: 9-18V to ±15V, Iout (max) ±200mA, 6W DC-DC Converter; Manufacturer: TRACO POWER; PressFit: No; Bonding: No; Part Number: TEN 5-1223; Component Kind: Standard; Component Type: Standard; Device: TEN 5-1223; Footprint: DCDC_TRACO_TEN5; PackageDescription: TEN 5 Series, Body 32.5x20.5mm, DIP-24 Package with Standard Pinout; Part Description: 9-18V to ±15V, Iout (max) ±200mA, 6W DC-DC Converter; Manufacturer Part Number: TEN 5-1223; Pin Count: 8; Mounted: Yes; Socket: No; SMD: No; Sense: No; ComponentHeight: 10.5mm; HelpURL: \\cern.ch\dfs\Applications\Altium\Datasheets\TEN 5-2423WI.pdf; Author: GK; CreateDate: 24.04.2017; LatestRevisionDate: 24.04.2017
IC33 IC34 = LT1964ES5-SD#TRMPBF: 200mA, Low Noise, Low Dropout Negative Micropower Regulator; Part Description: -1.22V to -20V, 200mA, Low Noise, Low Dropout Negative Micropower Regulator; Manufacturer: LINEAR TECHNOLOGY; PressFit: No; Bonding: No; Part Number: LT1964ES5-SD#TRMPBF; Component Kind: Standard; Component Type: Standard; Device: LT1964ES5-SD#TRMPBF; PackageDescription: SOT23, 0.95mm pitch; 5 pin, 1.75mm W X 3.00mm L, IPC Medium Density; Manufacturer Part Number: LT1964ES5-SD#TRMPBF; Pin Count: 5; Case: SOT23-5; Mounted: Yes; Socket: No; SMD: Yes; Sense: No; ComponentHeight: 1mm; HelpURL: \\cern.ch\dfs\Applications\Altium\Datasheets\LT1964ES5-SD#TRMPBF.pdf; Author: CERN DEM JLC; CreateDate: 05.05.2009; LatestRevisionDate: 05.05.2009
IC35 = TPS62175DQC: 4.75-28VDC to 1-6VDC, 500mA Step-Down Converter With Sleep Mode; Manufacturer: TEXAS INSTRUMENTS; PressFit: No; Bonding: No; Part Number: TPS62175DQC; Component Kind: Standard; Component Type: Standard; Device: TPS62175DQC; PackageDescription: SON, 10-Leads, Body 2x3mm, Pitch 0.5mm, Thermal Pad 0.94x2.5mm, IPC Medium Density; Part Description: 4.75-28VDC to 1-6VDC, 500mA Step-Down Converter With Sleep Mode; Manufacturer Part Number: TPS62175DQC; Pin Count: 11; Case: SON10; Mounted: Yes; Socket: No; SMD: Yes; Sense: No; ComponentHeight: 0.8mm; HelpURL: \\cern.ch\dfs\Applications\Altium\Datasheets\TPS62175DQC.pdf; Author: CERN DEM JMW; CreateDate: 11.08.2015; LatestRevisionDate: 11.08.2015
L6-L9 L15 L16 = IND_10UH_10%_MURATA-PS_8400: Inductor With Core; Part Description: Miniature Surface Mount Power Inductor (8400 Serie); Manufacturer: MURATA POWER SOLUTIONS; Manufacturer Part Number: 84103C; Power: 950mA; Resistance: 0.24R; Tolerance: ±10%; Part Number: IND_10UH_10%_MURATA-PS_8400; Component Kind: Standard; Component Type: Standard; Pin Count: 2; Value: 10uH; Status: None; Mounted: Yes; Socket: No; SMD: Yes; Sense: No; ComponentHeight: 2.9mm; HelpURL: \\cern.ch\dfs\Applications\Altium\Datasheets\IND_MURATA-PS_8400.pdf; Author: CERN DEM JLC; CreateDate: 02.07.2012; LatestRevisionDate: 02.07.2012
R69 R150 = R0603_16K_1%_0.1W_100PPM: Resistor - 1%; Part Description: General Purpose Thick Film Chip Resistor; Manufacturer: GENERIC; Manufacturer1 Part Number: NRC06F1602TRF; Power: 0.1W; TC: ±100ppm/°C; Part Number: R0603_16K_1%_0.1W_100PPM; Component Kind: Standard; Component Type: Standard; Pin Count: 2; Value: 16k; Status: Preferred; Tolerance: ±1%; Manufacturer Part Number: R0603_16K_1%_0.1W_100PPM; Case: 0603; Mounted: Yes; Sense: No; Socket: No; SMD: Yes; Manufacturer1 Example: NIC COMPONENT; Manufacturer1 ComponentHeight: 0.55mm; HelpURL: \\cern.ch\dfs\Applications\Altium\Datasheets\R0603_NIC_NRC.pdf; Author: CERN DEM JLC; CreateDate: 03.12.2007; LatestRevisionDate: 13.03.2008
R70 R153 = R0603_1K5_1%_0.1W_100PPM: Resistor - 1%; Part Description: General Purpose Thick Film Chip Resistor; Manufacturer: GENERIC; Manufacturer1 Part Number: NRC06F1501TRF; Power: 0.1W; TC: ±100ppm/°C; Part Number: R0603_1K5_1%_0.1W_100PPM; Component Kind: Standard; Component Type: Standard; Pin Count: 2; Value: 1k5; Status: Preferred; Tolerance: ±1%; Manufacturer Part Number: R0603_1K5_1%_0.1W_100PPM; Case: 0603; Mounted: Yes; Sense: No; Socket: No; SMD: Yes; Manufacturer1 Example: NIC COMPONENT; Manufacturer1 ComponentHeight: 0.55mm; HelpURL: \\cern.ch\dfs\Applications\Altium\Datasheets\R0603_NIC_NRC.pdf; Author: CERN DEM JLC; CreateDate: 03.12.2007; LatestRevisionDate: 13.03.2008
R154 = R0603_24K_1%_0.1W_100PPM: Resistor - 1%; Part Description: General Purpose Thick Film Chip Resistor; Manufacturer: GENERIC; Manufacturer1 Part Number: NRC06F2402TRF; Power: 0.1W; TC: ±100ppm/°C; Part Number: R0603_24K_1%_0.1W_100PPM; Component Kind: Standard; Component Type: Standard; Pin Count: 2; Value: 24k; Status: Preferred; Tolerance: ±1%; Manufacturer Part Number: R0603_24K_1%_0.1W_100PPM; Case: 0603; Mounted: Yes; Sense: No; Socket: No; SMD: Yes; Manufacturer1 Example: NIC COMPONENT; Manufacturer1 ComponentHeight: 0.55mm; HelpURL: \\cern.ch\dfs\Applications\Altium\Datasheets\R0603_NIC_NRC.pdf; Author: CERN DEM JLC; CreateDate: 03.12.2007; LatestRevisionDate: 13.03.2008
R155 = R0603_2K7_1%_0.1W_100PPM: Resistor - 1%; Part Description: General Purpose Thick Film Chip Resistor; Manufacturer: GENERIC; Manufacturer1 Part Number: RC0603FR-072K7L; Power: 0.1W; TC: ±100ppm/°C; Part Number: R0603_2K7_1%_0.1W_100PPM; Component Kind: Standard; Component Type: Standard; Pin Count: 2; Value: 2k7; Status: Preferred; Tolerance: ±1%; Manufacturer Part Number: R0603_2K7_1%_0.1W_100PPM; Case: 0603; Mounted: Yes; Sense: No; Socket: No; SMD: Yes; Manufacturer1 Example: YAGEO PHYCOMP; Manufacturer1 ComponentHeight: 0.55mm; HelpURL: \\cern.ch\dfs\Applications\Altium\Datasheets\R0603_PHYCOMP_RC0603.pdf; Author: CERN DEM JLC; CreateDate: 02.05.2011; LatestRevisionDate: 02.05.2011
R156 R159 = R0603_11K_1%_0.1W_100PPM: Resistor - 1%; Part Description: General Purpose Thick Film Chip Resistor; Manufacturer: GENERIC; Manufacturer1 Part Number: NRC06F1102TRF; Power: 0.1W; TC: ±100ppm/°C; Part Number: R0603_11K_1%_0.1W_100PPM; Component Kind: Standard; Component Type: Standard; Pin Count: 2; Value: 11k; Status: Preferred; Tolerance: ±1%; Manufacturer Part Number: R0603_11K_1%_0.1W_100PPM; Case: 0603; Mounted: Yes; Sense: No; Socket: No; SMD: Yes; Manufacturer1 Example: NIC COMPONENT; Manufacturer1 ComponentHeight: 0.55mm; HelpURL: \\cern.ch\dfs\Applications\Altium\Datasheets\R0603_NIC_NRC.pdf; Author: CERN DEM JLC; CreateDate: 03.12.2007; LatestRevisionDate: 13.03.2008
R158 R161 = R0603_1K_1%_0.1W_100PPM: Resistor - 1%; Part Description: General Purpose Thick Film Chip Resistor; Manufacturer: GENERIC; Manufacturer1 Part Number: NRC06F1001TRF; Power: 0.1W; TC: ±100ppm/°C; Part Number: R0603_1K_1%_0.1W_100PPM; Component Kind: Standard; Component Type: Standard; Pin Count: 2; Value: 1k; Status: Preferred; Tolerance: ±1%; Manufacturer Part Number: R0603_1K_1%_0.1W_100PPM; Case: 0603; Mounted: Yes; Sense: No; Socket: No; SMD: Yes; Manufacturer1 Example: NIC COMPONENT; Manufacturer1 ComponentHeight: 0.55mm; HelpURL: \\cern.ch\dfs\Applications\Altium\Datasheets\R0603_NIC_NRC.pdf; Author: CERN DEM JLC; CreateDate: 03.12.2007; LatestRevisionDate: 13.03.2008
R162 = R0603_270K_1%_0.1W_100PPM: Resistor - 1%; Part Description: General Purpose Thick Film Chip Resistor; Manufacturer: GENERIC; Manufacturer1 Part Number: NRC06F2703TRF; Power: 0.1W; TC: ±100ppm/°C; Part Number: R0603_270K_1%_0.1W_100PPM; Component Kind: Standard; Component Type: Standard; Pin Count: 2; Value: 270k; Status: Preferred; Tolerance: ±1%; Manufacturer Part Number: R0603_270K_1%_0.1W_100PPM; Case: 0603; Mounted: Yes; Sense: No; Socket: No; SMD: Yes; Manufacturer1 Example: NIC COMPONENT; Manufacturer1 ComponentHeight: 0.55mm; HelpURL: \\cern.ch\dfs\Applications\Altium\Datasheets\R0603_NIC_NRC.pdf; Author: CERN DEM JLC; CreateDate: 03.12.2007; LatestRevisionDate: 13.03.2008
R164 = R0603_82K_1%_0.1W_100PPM: Resistor - 1%; Part Description: General Purpose Thick Film Chip Resistor; Manufacturer: GENERIC; Manufacturer1 Part Number: NRC06F8202TRF; Power: 0.1W; TC: ±100ppm/°C; Part Number: R0603_82K_1%_0.1W_100PPM; Component Kind: Standard; Component Type: Standard; Pin Count: 2; Value: 82k; Status: Preferred; Tolerance: ±1%; Manufacturer Part Number: R0603_82K_1%_0.1W_100PPM; Case: 0603; Mounted: Yes; Sense: No; Socket: No; SMD: Yes; Manufacturer1 Example: NIC COMPONENT; Manufacturer1 ComponentHeight: 0.55mm; HelpURL: \\cern.ch\dfs\Applications\Altium\Datasheets\R0603_NIC_NRC.pdf; Author: CERN DEM JLC; CreateDate: 03.12.2007; LatestRevisionDate: 13.03.2008